# Altium project H_Bridge_GateFet.PrjPcb
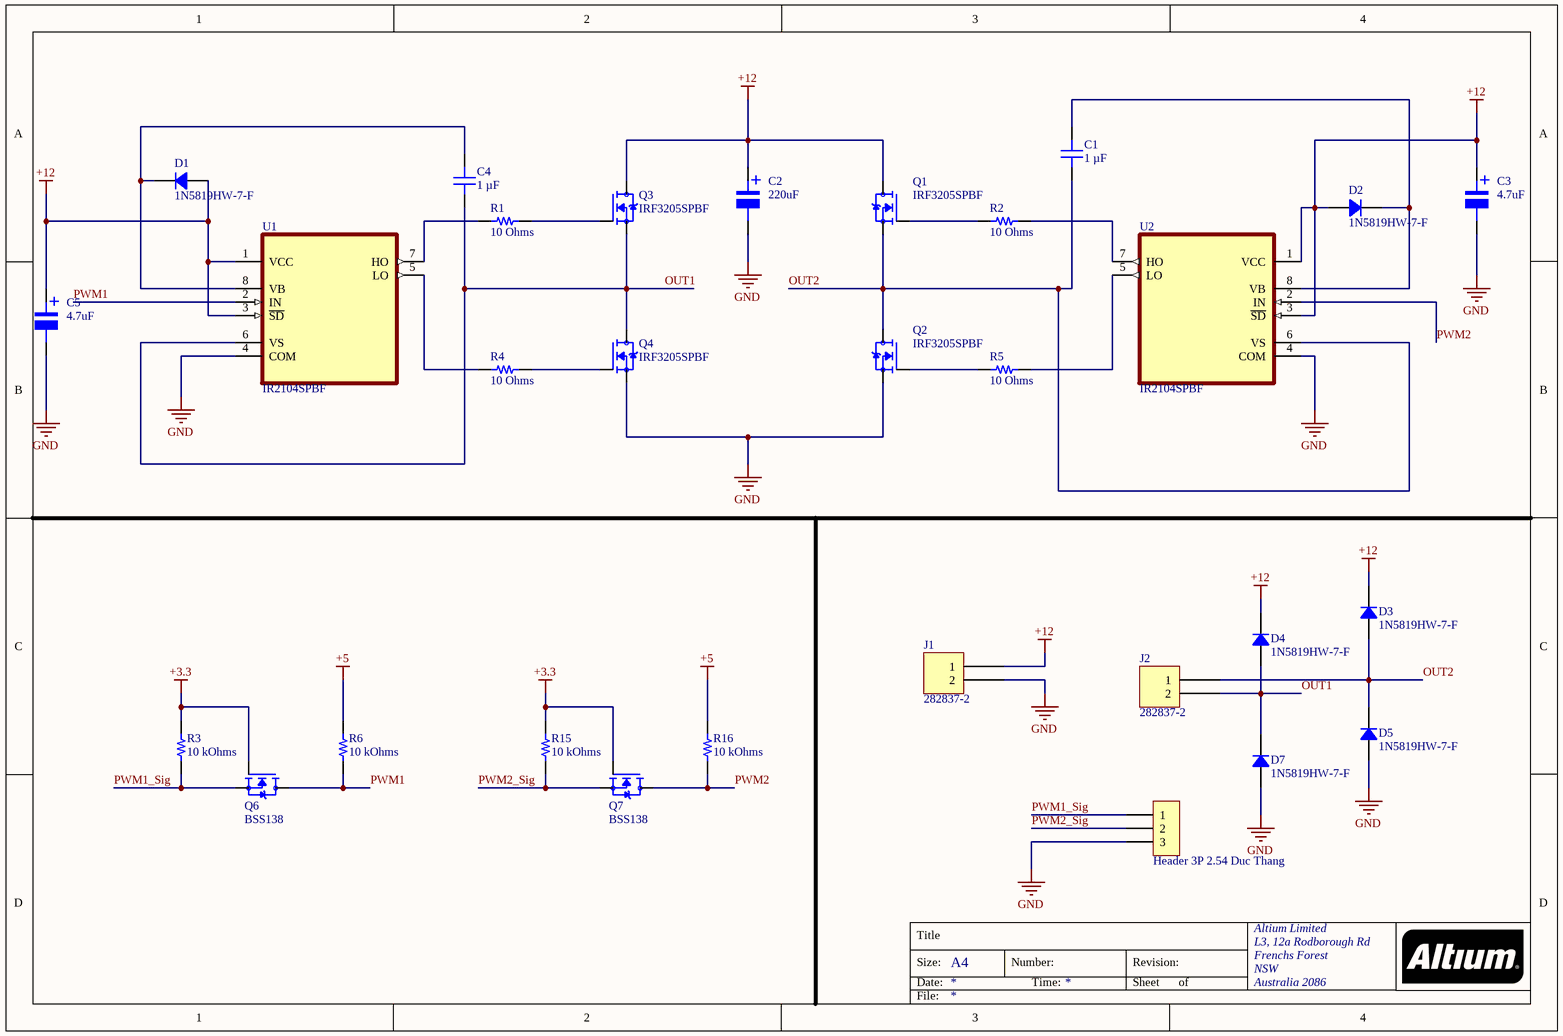
[diagram p0: H_Bridge_Mosate.SchDoc]
2 sheets, 49 parts. Net scope: global (net labels, ports and power ports of the same name join across sheets).
Board file: H-bridge.PcbDoc
Sheets:
  H_Bridge_Mosate.SchDoc
  Power.SchDoc

## Sheet H_Bridge_Mosate.SchDoc
size A4; Organization: Altium Limited; Address1: L3, 12a Rodborough Rd; Address2: Frenchs Forest; Address3: NSW; Address4: Australia 2086

### Parts
C1  1 µF  [CAP 0603_1608]
C2  220uF  [tu nhom 8 (f)]
C3  4.7uF  [tu nhom 4 (b)]
C4  1 µF  [CAP 0603_1608]
C5  4.7uF  [tu nhom 4 (b)]
D1  1N5819HW-7-F  [SOD-123]
D2  1N5819HW-7-F  [SOD-123]
D3  1N5819HW-7-F  [SOD-123]
D4  1N5819HW-7-F  [SOD-123]
D5  1N5819HW-7-F  [SOD-123]
D7  1N5819HW-7-F  [SOD-123]
H1  Header 3P 2.54 Duc Thang  [XH2.54M-3]
J1  282837-2  [TE 282837-2]
J2  282837-2  [TE 282837-2]
Q1  IRF3205SPBF  [TRANS_IRF3205SPBF]
Q2  IRF3205SPBF  [TRANS_IRF3205SPBF]
Q3  IRF3205SPBF  [TRANS_IRF3205SPBF]
Q4  IRF3205SPBF  [TRANS_IRF3205SPBF]
Q6  BSS138  [SOT95P240X111-3N]
Q7  BSS138  [SOT95P240X111-3N]
R1  10 Ohms  [RES 0603_1608]
R2  10 Ohms  [RES 0603_1608]
R3  10 kOhms  [RES 0603_1608]
R4  10 Ohms  [RES 0603_1608]
R5  10 Ohms  [RES 0603_1608]
R6  10 kOhms  [RES 0603_1608]
R15  10 kOhms  [RES 0603_1608]
R16  10 kOhms  [RES 0603_1608]
U1  IR2104SPBF  [SOIC127P600X175-8N]
U2  IR2104SPBF  [SOIC127P600X175-8N]

### Nets
+3.3: Q6.1(G) Q7.1(G) R3.2 R15.2
+5: R6.2 R16.2
+12: C2.1 C3.1 C5.1 D1.1 D2.1 D3.2 D4.2 J1.1 Q1.2(D) Q3.2(D) U1.1(VCC) U1.3(~{SD}) U2.1(VCC) U2.3(~{SD})
GND: C2.2 C3.2 C5.2 D5.1 D7.1 H1.3 J1.2 Q2.3(S) Q4.3(S) U1.4(COM) U2.4(COM)
OUT1: C4.1 D4.1 D7.2 J2.2 Q3.3(S) Q4.2(D) U1.6(VS)
OUT2: C1.1 D3.1 D5.2 J2.1 Q1.3(S) Q2.2(D) U2.6(VS)
PWM1: Q6.3(D) R6.1 U1.2(IN)
PWM1_Sig: H1.1 Q6.2(S) R3.1
PWM2: Q7.3(D) R16.1 U2.2(IN)
PWM2_Sig: H1.2 Q7.2(S) R15.1
NetC1_2: C1.2 D2.2 U2.8(VB)
NetC4_2: C4.2 D1.2 U1.8(VB)
NetQ1_1: Q1.1(G) R2.1
NetQ2_1: Q2.1(G) R5.1
NetQ3_1: Q3.1(G) R1.2
NetQ4_1: Q4.1(G) R4.2
NetR1_1: R1.1 U1.7(HO)
NetR2_2: R2.2 U2.7(HO)
NetR4_1: R4.1 U1.5(LO)
NetR5_2: R5.2 U2.5(LO)

### Notes on the sheet
- Title
- Size:
- Date:
- A4
- Number:
- Time:
- Revision:
- Sheet
- of
- File:
- (in symbol Tu Nhom 4.7uF 25V) +
- (in symbol Tu Nhom 220uF 25V) +

### Library data of the parts
C1 C4 = GCG188L8EE105KA07D: CAP CER 1UF 16V X8L 0603; manufacturer: Murata Electronics; Tolerance: ±10%; Part Number: GCG188L8EE105KA07D; Value: 1 µF; Applications: Automotive; Capacitance: 1 µF; componentlink2description: DigiKey Link; componentlink2url: https://www.digikey.com/en/products/detail/murata-electronics/GCG188L8EE105KA07D/10695125; Device Package: 0603 (1608 Metric); Features: Epoxy Mountable; lastupdated: 2/9/2024 8:09:54 PM; Lifecycle Status: Active; Minimum Order: 1; Mounting Type: Surface Mount, MLCC; Operating Temperature: -55°C ~ 150°C; Package / Case: 0603 (1608 Metric); packaging: TapeAndReel; partid: 46174; Part Status: Active; price: 0.04; Ratings: AEC-Q200; series: GCG; Size / Dimension: 0.063" L x 0.031" W (1.60mm x 0.80mm); Supplier 1: DigiKey; Supplier Part Number 1: 490-GCG188L8EE105KA07DCT-ND; Temperature Coefficient: X8L; Thickness (Max): 0.035" (0.90mm); Voltage - Rated: 16V
C2 = Tu Nhom 220uF 25V: Dán; Don_Vi: Con; So_Chan: 2; Ten_Linh_Kien: Tụ Nhôm 220uF 25V; Ma_Hang: MH002221; Chung_Loai: Dán; Kieu_Chan: *
C3 C5 = Tu Nhom 4.7uF 25V: Dán; Don_Vi: Con; So_Chan: 2; Ten_Linh_Kien: Tụ Nhôm 4.7uF 25V 4x4.5MM; Ma_Hang: MH003790; Chung_Loai: Dán; Kieu_Chan: *
D1-D5 D7 = 1N5819HW-7-F: DIODE SCHOTTKY 40V 1A SOD123; Manufacturer: Diodes Incorporated; Capacitance @ Vr, F: 60pF @ 4V, 1MHz; Current - Reverse Leakage @ Vr: 1 mA @ 40 V; Speed: Fast Recovery =< 500ns, > 200mA (Io); Voltage - Forward (Vf) (Max) @ If: 450 mV @ 1 A; Part Number: 1N5819HW-7-F; ComponentLink1Description: Datasheet; ComponentLink1URL: https://www.diodes.com/assets/Datasheets/ds30217.pdf; ComponentLink2Description: DigiKey Link; ComponentLink2URL: https://www.digikey.com/en/products/detail/diodes-incorporated/1N5819HW-7-F/814970; Current - Average Rectified (Io): 1A; Diode Type: Schottky; LastUpdated: 6/3/2024 7:54:46 PM; Lifecycle Status: Active; Minimum Order: 1; Mounting Type: Surface Mount; Operating Temperature - Junction: -65°C ~ 125°C; Package / Case: SOD-123; Packaging: TapeAndReel; PartId: 2212; Part Status: Active; Price: 0.05; Series: -; Supplier 1: DigiKey; Supplier Part Number 1: 1N5819HW-FDICT-ND; Supplier Device Package: SOD-123; Voltage - DC Reverse (Vr) (Max): 40 V
H1 = Header 3P 2.54 Duc Thang: Cắm; Ten_Linh_Kien: Header 3P XH2.54-3P Đực Thẳng; Don_Vi: Con; Ma_Hang: MH001292; Chung_Loai: Cắm
J1 J2 = 282837-2: TERM BLK 2P SIDE ENT 5.08MM PCB; Manufacturer: TE Connectivity AMP Connectors; Current: 13.5 A; Mating Orientation: Horizontal with Board; Number of Levels: 1; Pitch: 0.200" (5.08mm); Positions Per Level: 2; Voltage: 300 V; Wire Gauge: 16-28 AWG; Wire Termination: Screw - Rising Cage Clamp; Part Number: 282837-2; Color: Green; ComponentLink1Description: Datasheet; ComponentLink1URL: https://www.te.com/commerce/DocumentDelivery/DDEController?Action=srchrtrv&DocNm=282837&DocType=Customer+Drawing&DocLang=English; ComponentLink2Description: DigiKey Link; ComponentLink2URL: https://www.digikey.com/en/products/detail/te-connectivity-amp-connectors/282837-2/2187973; Features: Interlocking (Side); LastUpdated: 6/21/2022 3:00:23 PM; Lifecycle Status: Active; Minimum Order: 1; Mounting Type: Through Hole; Packaging: Tray; Part Status: Active; Price: 0.31; Series: Buchanan; Supplier 1: DigiKey; Supplier Part Number 1: A113320-ND
Q1-Q4 = IRF3205SPBF: RoHS Compliant | Low RDS_on_ | Industry-leading quality | Dynamic dv/dt Rating | Fast Switching | Fully Avalanche Rated | 175C Operating Temperature; MF: Infineon Technologies; Package: D2PAK Infineon; Price: None; SnapEDA_Link: https://www.snapeda.com/parts/IRF3205SPBF/Infineon%20Technologies/view-part/576468/?ref=snap; Availability: Unavailable; Value: *; MP: IRF3205SPBF
Q6 Q7 = BSS138: N-Channel 50 V 220mA (Ta) 350mW (Ta) Surface Mount SOT-23-3; MF: onsemi; SnapEDA_Link: https://www.snapeda.com/parts/BSS138/Onsemi/view-part/?ref=snap; Package: SOT-23-3 Motorola; Value: *; MP: BSS138; Check_prices: https://www.snapeda.com/parts/BSS138/Onsemi/view-part/?ref=eda
R1 R2 R4 R5 = ERJ-UP3F10R0V: RES 10 OHM 1% 1/4W 0603; Manufacturer: Panasonic Electronic Components; Power (Watts): 0.25W, 1/4W; Temperature Coefficient: ±100ppm/°C; Part Number: ERJ-UP3F10R0V; Value: 10 Ohms; ComponentLink1Description: Datasheet; ComponentLink1URL: https://b2b-api.panasonic.eu/file_stream/pids/fileversion/4484; ComponentLink2Description: DigiKey Link; ComponentLink2URL: https://www.digikey.com/en/products/detail/panasonic-electronic-components/ERJ-UP3F10R0V/12092098; Composition: Thick Film; Device Package: 0603 (1608 Metric); Features: Anti-Sulfur, Automotive AEC-Q200, Pulse Withstanding; Height - Seated (Max): 0.022" (0.55mm); LastUpdated: 2/9/2024 8:41:13 PM; Lifecycle Status: Active; Minimum Order: 1; Number of Terminations: 2; Operating Temperature: -55°C ~ 155°C; Package / Case: 0603 (1608 Metric); Packaging: TapeAndReel; PartId: 66744; Part Status: Active; Price: 0.02; Ratings: AEC-Q200; Resistance: 10 Ohms; Series: ERJ-UP3; Size / Dimension: 0.063" L x 0.031" W (1.60mm x 0.80mm); Supplier 1: DigiKey; Supplier Part Number 1: 10-ERJ-UP3F10R0VCT-ND; Supplier Device Package: 0603; Tolerance: ±1%
R3 R6 R15 R16 = AC0603FR-0710KL: RES SMD 10K OHM 1% 1/10W 0603; Manufacturer: Yageo; Power (Watts): 0.1W, 1/10W; Temperature Coefficient: ±100ppm/°C; Part Number: AC0603FR-0710KL; Value: 10 kOhms; ComponentLink1Description: Datasheet; ComponentLink1URL: https://www.yageo.com/upload/media/product/productsearch/datasheet/rchip/PYu-AC_51_RoHS_L_7.pdf; ComponentLink2Description: DigiKey Link; ComponentLink2URL: https://www.digikey.com/en/products/detail/yageo/AC0603FR-0710KL/2827814; Composition: Thick Film; Device Package: 0603 (1608 Metric); Features: Automotive AEC-Q200, Moisture Resistant; Height - Seated (Max): 0.022" (0.55mm); LastUpdated: 2/9/2024 8:42:48 PM; Lifecycle Status: Active; Minimum Order: 1; Number of Terminations: 2; Operating Temperature: -55°C ~ 155°C; Package / Case: 0603 (1608 Metric); Packaging: CutTape; PartId: 17347; Part Status: Active; Price: 0.01; Ratings: AEC-Q200; Resistance: 10 kOhms; Series: AC; Size / Dimension: 0.063" L x 0.031" W (1.60mm x 0.80mm); Supplier 1: DigiKey; Supplier Part Number 1: 311-10KLDCT-ND; Supplier Device Package: 0603; Tolerance: ±1%
U1 U2 = IR2104SPBF: Floating channel designed for bootstrap operation | Fully operational to +600 V | Tolerant to negative transient voltage | dV/dt immune | Gate drive supply range from 10 to 20 V | Undervoltage lockout | 3.3 V, 5 V, and 15 V logic input compatible | Cross-conduction prevention logic | Matched propagation delay for both channels | Internal set deadtime | High side output in phase with HIN input | Shut down input turns off both channels; MF: Infineon; Purchase-URL: https://pricing.snapeda.com/search/part/IR2104SPBF/?ref=eda; MP: IR2104SPBF; SnapEDA_Link: https://www.snapeda.com/parts/IR2104SPBF/Infineon%20Technologies/view-part/61964/?ref=snap; Price: None; Package: SOIC-8 International Rectifier; Value: *; Availability: Warning; Check_prices: https://www.snapeda.com/parts/IR2104SPBF/Infineon%20Technologies/view-part/61964/?ref=eda

## Sheet Power.SchDoc
size A4; Organization: Altium Limited; Address1: L3, 12a Rodborough Rd; Address2: Frenchs Forest; Address3: NSW; Address4: Australia 2086
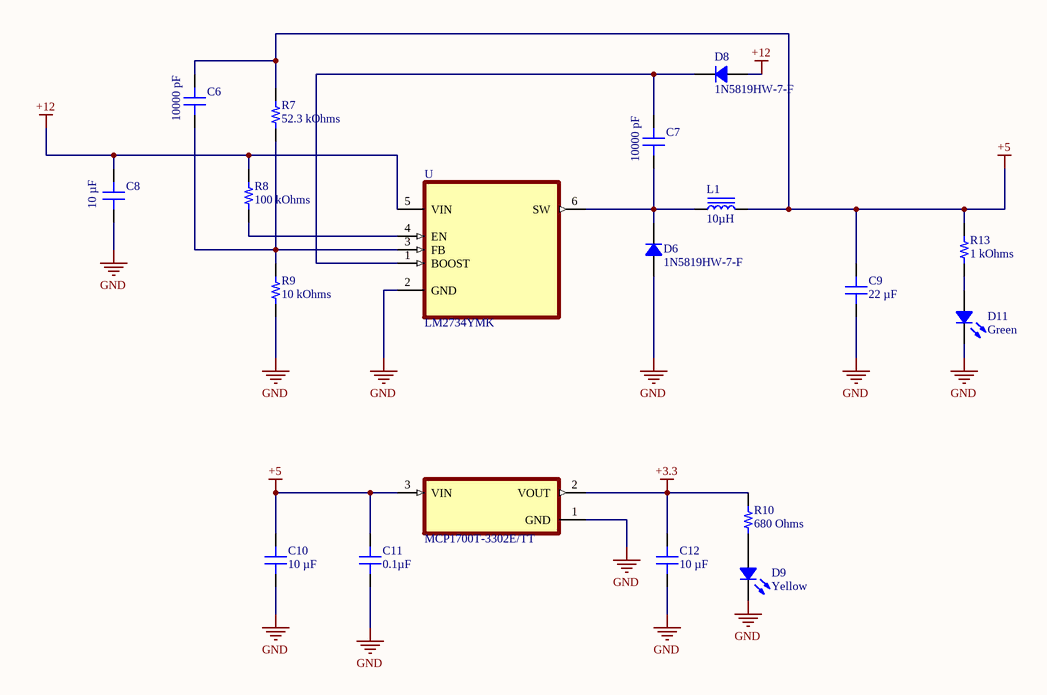
[diagram p1: Power.SchDoc]

### Parts
C6  10000 pF  [CAP 0603_1608]
C7  10000 pF  [CAP 0603_1608]
C8  10 µF  [CAP 0805_2012]
C9  22 µF  [CAP 0805_2012]
C10  10 µF  [CAP 0805_2012]
C11  0.1µF  [CAP 0603_1608]
C12  10 µF  [CAP 0805_2012]
D6  1N5819HW-7-F  [SOD-123]
D8  1N5819HW-7-F  [SOD-123]
D9  Yellow  [LED 0603_1608 YELLOW]
D11  Green  [LED 0402_1005 GREEN]
L1  10µH  [TDK SLF7032]
R7  52.3 kOhms  [RES 0603_1608]
R8  100 kOhms  [RES 0603_1608]
R9  10 kOhms  [RES 0603_1608]
R10  680 Ohms  [RES 0603_1608]
R13  1 kOhms  [RES 0603_1608]
U  LM2734YMK  [SOT95P285X100-6N]
  MCP1700T-3302E/TT  [SOT95P237X112-3N]

### Nets
+3.3: C12.2 R10.2 .2(VOUT)
+5: C6.2 C9.2 C10.2 C11.2 L1.2 R7.2 R13.2 .3(VIN)
+12: C8.2 D8.1 R8.2 U.5(VIN)
GND: C8.1 C9.1 C10.1 C11.1 C12.1 D6.1 D9.2 D11.2 R9.1 U.2(GND) .1(GND)
NetC6_1: C6.1 R7.1 R9.2 U.3(FB)
NetC7_1: C7.1 D6.2 L1.1 U.6(SW)
NetC7_2: C7.2 D8.2 U.1(BOOST)
NetD9_1: D9.1 R10.1
NetD11_1: D11.1 R13.1
NetR8_1: R8.1 U.4(EN)

### Notes on the sheet
- Title
- Size:
- Date:
- A4
- Number:
- Time:
- Revision:
- Sheet
- of
- File:

### Library data of the parts
C6 C7 = C0603C103K4RECAUTO: CAP CER 0603 10NF 16V X7R 10%; manufacturer: KEMET; Part Number: C0603C103K4RECAUTO; Value: 10000 pF; Applications: Automotive, ESD Protection; Capacitance: 10000 pF; componentlink1description: Datasheet; componentlink1url: https://api.kemet.com/component-edge/download/datasheet/C0603C103K4RECAUTO.pdf; componentlink2description: DigiKey Link; componentlink2url: https://www.digikey.com/en/products/detail/kemet/C0603C103K4RECAUTO/8640474; Device Package: 0603 (1608 Metric); lastupdated: 2/9/2024 8:10:22 PM; Lifecycle Status: Active; Minimum Order: 1; Mounting Type: Surface Mount, MLCC; Operating Temperature: -55°C ~ 125°C; Package / Case: 0603 (1608 Metric); packaging: TapeAndReel; partid: 8251; Part Status: Active; price: 0.01; Ratings: AEC-Q200; series: ESD SMD Auto X7R; Size / Dimension: 0.063" L x 0.031" W (1.60mm x 0.80mm); Supplier 1: DigiKey; Supplier Part Number 1: 399-17880-1-ND; Temperature Coefficient: X7R; Thickness (Max): 0.034" (0.87mm); Tolerance: ±10%; Voltage - Rated: 16V
C8 = CL21X106KAYNNNE: CAP CER 10UF 25V X6S 0805; manufacturer: Samsung Electro-Mechanics; Tolerance: ±10%; Part Number: CL21X106KAYNNNE; Value: 10 µF; Applications: General Purpose; Capacitance: 10 µF; componentlink1description: Datasheet; componentlink1url: http://www.samsungsem.com/kr/support/product-search/mlcc/CL21X106KAYNNNE.jsp; componentlink2description: DigiKey Link; componentlink2url: https://www.digikey.com/en/products/detail/samsung-electro-mechanics/CL21X106KAYNNNE/5961182; Device Package: 0805 (2012 Metric); lastupdated: 2/9/2024 8:16:03 PM; Lifecycle Status: Active; Minimum Order: 1; Mounting Type: Surface Mount, MLCC; Operating Temperature: -55°C ~ 105°C; Package / Case: 0805 (2012 Metric); packaging: TapeAndReel; partid: 4781; Part Status: Active; price: 0.04; series: CL; Size / Dimension: 0.079" L x 0.049" W (2.00mm x 1.25mm); Supplier 1: DigiKey; Supplier Part Number 1: 1276-6698-1-ND; Temperature Coefficient: X6S; Thickness (Max): 0.057" (1.45mm); Voltage - Rated: 25V
C9 = CL21A226KQQNNNE: CAP CER 22UF 6.3V X5R 0805; manufacturer: Samsung Electro-Mechanics; Tolerance: ±10%; Part Number: CL21A226KQQNNNE; Value: 22 µF; Applications: General Purpose; Capacitance: 22 µF; componentlink1description: Datasheet; componentlink1url: http://www.samsungsem.com/kr/support/product-search/mlcc/CL21A226KQQNNNE.jsp; componentlink2description: DigiKey Link; componentlink2url: https://www.digikey.com/en/products/detail/samsung-electro-mechanics/CL21A226KQQNNNE/3888565; Device Package: 0805 (2012 Metric); lastupdated: 2/9/2024 8:16:07 PM; Lifecycle Status: Active; Minimum Order: 1; Mounting Type: Surface Mount, MLCC; Operating Temperature: -55°C ~ 85°C; Package / Case: 0805 (2012 Metric); packaging: TapeAndReel; partid: 3051; Part Status: Active; price: 0.03; series: CL; Size / Dimension: 0.079" L x 0.049" W (2.00mm x 1.25mm); Supplier 1: DigiKey; Supplier Part Number 1: 1276-2907-1-ND; Temperature Coefficient: X5R; Thickness (Max): 0.055" (1.40mm); Voltage - Rated: 6.3V
C10 C12 = C2012X6S1C106K125AC: CAP CER 10UF 16V X6S 0805; manufacturer: TDK Corporation; Tolerance: ±10%; Part Number: C2012X6S1C106K125AC; Value: 10 µF; Applications: General Purpose; Capacitance: 10 µF; componentlink1description: Datasheet; componentlink1url: https://product.tdk.com/info/en/catalog/datasheets/mlcc_commercial_general_en.pdf?ref_disty=digikey; componentlink2description: DigiKey Link; componentlink2url: https://www.digikey.com/en/products/detail/tdk-corporation/C2012X6S1C106K125AC/2733046; Device Package: 0805 (2012 Metric); Features: Low ESL; lastupdated: 2/9/2024 8:16:08 PM; Lifecycle Status: Active; Minimum Order: 1; Mounting Type: Surface Mount, MLCC; Operating Temperature: -55°C ~ 105°C; Package / Case: 0805 (2012 Metric); packaging: TapeAndReel; partid: 2995; Part Status: Active; price: 0.06; series: C; Size / Dimension: 0.079" L x 0.049" W (2.00mm x 1.25mm); Supplier 1: DigiKey; Supplier Part Number 1: 445-7611-1-ND; Temperature Coefficient: X6S; Thickness (Max): 0.057" (1.45mm); Voltage - Rated: 16V
C11 = 0603YC104K4T4A: CAP CER 0.1UF 16V X7R 0603; manufacturer: AVX Corporation; Tolerance: ±10%; Part Number: 0603YC104K4T4A; Value: 0.1µF; Applications: Automotive; Capacitance: 0.1µF; componentlink1description: Datasheet; componentlink1url: http://datasheets.avx.com/AutoMLCC.pdf; componentlink2description: DigiKey Link; componentlink2url: http://digikey.com/product-detail/en/avx-corporation/0603YC104K4T4A/478-9382-1-ND/4901449; Device Package: 0603 (1608 Metric); lastupdated: 9/2/2020 1:03:04 AM; Lifecycle Status: Active; Minimum Order: 1; Mounting Type: Surface Mount, MLCC; Operating Temperature: -55°C ~ 125°C; Package / Case: 0603 (1608 Metric); packaging: TapeAndReel; partid: 17140; Part Status: Active; price: 0.02; Ratings: AEC-Q200; series: -; Size / Dimension: 0.063" L x 0.032" W (1.60mm x 0.81mm); Supplier 1: DigiKey; Supplier Part Number 1: 478-9382-1-ND; Temperature Coefficient: X7R; Thickness (Max): 0.035" (0.90mm); Voltage - Rated: 16V
D6 D8 = 1N5819HW-7-F: as D1 on sheet H_Bridge_Mosate; Part Number: 1N5819HW-7-F; ComponentLink1Description: Datasheet; ComponentLink1URL: https://www.diodes.com/assets/Datasheets/ds30217.pdf; ComponentLink2Description: DigiKey Link; ComponentLink2URL: https://www.digikey.com/en/products/detail/diodes-incorporated/1N5819HW-7-F/814970; Current - Average Rectified (Io): 1A; Diode Type: Schottky; LastUpdated: 6/3/2024 7:54:46 PM; Lifecycle Status: Active; Minimum Order: 1; Mounting Type: Surface Mount; Operating Temperature - Junction: -65°C ~ 125°C; Package / Case: SOD-123; Packaging: TapeAndReel; PartId: 2212; Part Status: Active; Price: 0.05; Series: -; Supplier 1: DigiKey; Supplier Part Number 1: 1N5819HW-FDICT-ND; Supplier Device Package: SOD-123; Voltage - DC Reverse (Vr) (Max): 40 V
D9 = IN-S63AT5Y: LED YELLOW CLEAR 0603 SMD; Manufacturer: Inolux; Configuration: Standard; Current - Test: 5mA; Lens Size: 1.15mm x 0.80mm; Lens Style: Rectangle with Flat Top; Millicandela Rating: 35mcd; Viewing Angle: 120°; Voltage - Forward (Vf) (Typ): 2V; Wavelength - Dominant: 589nm; Wavelength - Peak: 593nm; Part Number: IN-S63AT5Y; Color: Yellow; ComponentLink1Description: Datasheet; ComponentLink1URL: http://www.inolux-corp.com/datasheet/SMDLED/Mono%20Color%20Top%20View/IN-S63AT%20Series_V1.1.pdf; ComponentLink2Description: DigiKey Link; ComponentLink2URL: https://www.digikey.com/en/products/detail/inolux/IN-S63AT5Y/7604932; Device Package: 0603 (1608 Metric); Height (Max): 0.40mm; LastUpdated: 6/3/2024 8:01:09 PM; Lens Color: Clear; Lens Transparency: Clear; Lifecycle Status: Active; Minimum Order: 1; Mounting Type: Surface Mount; Package / Case: 0603 (1608 Metric); Packaging: TapeAndReel; PartId: 143; Part Status: Active; Price: 0.03; Series: IN-S63AT; Size / Dimension: 1.60mm L x 0.80mm W; Supplier 1: DigiKey; Supplier Part Number 1: 1830-1066-1-ND; Supplier Device Package: 0603; Value: Yellow
D11 = QBLP595-AG15-2897: LED GREEN CLEAR 0402 SMD; Manufacturer: QT Brightek (QTB); Configuration: Standard; Current - Test: 5mA; Lens Color: Colorless; Lens Size: 0.70mm x 0.50mm; Lens Style: Rectangle with Flat Top; Millicandela Rating: 16.5mcd; Viewing Angle: 140°; Voltage - Forward (Vf) (Typ): 1.9V; Wavelength - Dominant: 570nm; Part Number: QBLP595-AG15-2897; Color: Green; ComponentLink1Description: Datasheet; ComponentLink1URL: https://www.qt-brightek.com/datasheet/QBLP595-AG15-2897.pdf; ComponentLink2Description: DigiKey Link; ComponentLink2URL: https://www.digikey.com/en/products/detail/qt-brightek-qtb/QBLP595-AG15-2897/17049386; Device Package: 0402 (1005 Metric); Height (Max): 0.60mm; LastUpdated: 6/3/2024 7:58:13 PM; Lens Transparency: Clear; Lifecycle Status: Active; Minimum Order: 1; Mounting Type: Surface Mount; Package / Case: 0402 (1005 Metric); Packaging: TapeAndReel; PartId: 1262; Part Status: Active; Price: 0.04; Series: QBLP595; Size / Dimension: 1.00mm L x 0.50mm W; Supplier 1: DigiKey; Supplier Part Number 1: 1516-QBLP595-AG15-2897CT-ND; Supplier Device Package: 0402; Value: Green
L1 = SLF7032T-100M1R4-2PF: FIXED IND 10UH 1.4A 63.6 MOHM; Manufacturer: TDK Corporation; DC Resistance (DCR): 63.6mOhm Max; Inductance Frequency - Test: 100kHz; Material - Core: Ferrite; Shielding: Shielded; Tolerance: ±20%; Type: Wirewound; Part Number: SLF7032T-100M1R4-2PF; ComponentLink1Description: Datasheet; ComponentLink1URL: //media.digikey.com/pdf/Data%20Sheets/TDK%20PDFs/SLF7032_Type.pdf; ComponentLink2Description: DigiKey Link; ComponentLink2URL: http://digikey.com/product-detail/en/tdk-corporation/SLF7032T-100M1R4-2PF/445-1998-1-ND/755405; Current Rating (Amps): 1.4A; Device Package: Nonstandard; Height - Seated (Max): 0.134" (3.40mm); Inductance: 10µH; LastUpdated: 9/2/2020 1:30:24 AM; Lifecycle Status: Active; Minimum Order: 1; Mounting Type: Surface Mount; Operating Temperature: -40°C ~ 105°C; Package / Case: Nonstandard; Packaging: TapeAndReel; PartId: 3677; Part Status: Active; Price: 0.43; Series: SLF; Size / Dimension: 0.276" L x 0.276" W (7.00mm x 7.00mm); Supplier 1: DigiKey; Supplier Part Number 1: 445-1998-1-ND; Value: 10µH
R7 = ERA-3AEB5232V: RES SMD 52.3KOHM 0.1% 1/10W 0603; Manufacturer: Panasonic Electronic Components; Power (Watts): 0.1W, 1/10W; Temperature Coefficient: ±25ppm/°C; Part Number: ERA-3AEB5232V; Value: 52.3 kOhms; ComponentLink1Description: Datasheet; ComponentLink1URL: https://industrial.panasonic.com/cdbs/www-data/pdf/RDM0000/AOA0000C307.pdf; ComponentLink2Description: DigiKey Link; ComponentLink2URL: https://www.digikey.com/en/products/detail/panasonic-electronic-components/ERA-3AEB5232V/2026903; Composition: Thin Film; Device Package: 0603 (1608 Metric); Features: Automotive AEC-Q200; Height - Seated (Max): 0.022" (0.55mm); LastUpdated: 2/9/2024 8:42:09 PM; Lifecycle Status: Active; Minimum Order: 1; Number of Terminations: 2; Operating Temperature: -55°C ~ 155°C; Package / Case: 0603 (1608 Metric); Packaging: TapeAndReel; PartId: 24659; Part Status: Active; Price: 0.03; Ratings: AEC-Q200; Resistance: 52.3 kOhms; Series: ERA-3A; Size / Dimension: 0.063" L x 0.031" W (1.60mm x 0.80mm); Supplier 1: DigiKey; Supplier Part Number 1: P52.3KDBCT-ND; Supplier Device Package: 0603; Tolerance: ±0.1%
R8 = RCA0603100KJNEA: RES SMD 100K OHM 5% 1/10W 0603; Manufacturer: Vishay Dale; Power (Watts): 0.1W, 1/10W; Temperature Coefficient: ±200ppm/°C; Part Number: RCA0603100KJNEA; Value: 100 kOhms; ComponentLink1Description: Datasheet; ComponentLink1URL: http://www.vishay.com/docs/20037/rcae3.pdf; ComponentLink2Description: DigiKey Link; ComponentLink2URL: https://www.digikey.com/en/products/detail/vishay-dale/RCA0603100KJNEA/4946784; Composition: Thick Film; Device Package: 0603 (1608 Metric); Features: Anti-Sulfur, Automotive AEC-Q200; Height - Seated (Max): 0.020" (0.50mm); LastUpdated: 2/9/2024 8:42:20 PM; Lifecycle Status: Active; Minimum Order: 1; Number of Terminations: 2; Operating Temperature: -55°C ~ 155°C; Package / Case: 0603 (1608 Metric); Packaging: TapeAndReel; PartId: 23468; Part Status: Active; Price: 0.01; Ratings: AEC-Q200; Resistance: 100 kOhms; Series: RCA; Size / Dimension: 0.061" L x 0.033" W (1.55mm x 0.85mm); Supplier 1: DigiKey; Supplier Part Number 1: 541-2215-1-ND; Supplier Device Package: 0603; Tolerance: ±5%
R9 = TNPU060310K0BZEN00: RES SMD 10K OHM 0.1% 1/10W 0603; Manufacturer: Vishay Dale; Power (Watts): 0.1W, 1/10W; Temperature Coefficient: ±5ppm/°C; Part Number: TNPU060310K0BZEN00; Value: 10 kOhms; ComponentLink1Description: Datasheet; ComponentLink1URL: http://www.vishay.com/docs/28779/tnpue3.pdf; ComponentLink2Description: DigiKey Link; ComponentLink2URL: https://www.digikey.com/en/products/detail/vishay-dale/TNPU060310K0BZEN00/2238348; Composition: Thin Film; Device Package: 0603 (1608 Metric); Features: Anti-Sulfur, Automotive AEC-Q200, Moisture Resistant; Height - Seated (Max): 0.022" (0.55mm); LastUpdated: 2/9/2024 8:43:27 PM; Lifecycle Status: Active; Minimum Order: 1; Number of Terminations: 2; Operating Temperature: -55°C ~ 125°C; Package / Case: 0603 (1608 Metric); Packaging: TapeAndReel; PartId: 7183; Part Status: Active; Price: 0.88; Ratings: AEC-Q200; Resistance: 10 kOhms; Series: TNPU e3; Size / Dimension: 0.063" L x 0.033" W (1.60mm x 0.85mm); Supplier 1: DigiKey; Supplier Part Number 1: TNPU10.0KBACT-ND; Supplier Device Package: 0603; Tolerance: ±0.1%
R10 = RT0603CRD07680RL: RES SMD 680 OHM 0.25% 1/10W 0603; Manufacturer: Yageo; Power (Watts): 0.1W, 1/10W; Temperature Coefficient: ±25ppm/°C; Part Number: RT0603CRD07680RL; Value: 680 Ohms; ComponentLink1Description: Datasheet; ComponentLink1URL: https://www.yageo.com/upload/media/product/productsearch/datasheet/rchip/PYu-RT_1-to-0.01_RoHS_L_11.pdf; ComponentLink2Description: DigiKey Link; ComponentLink2URL: http://digikey.com/product-detail/en/yageo/RT0603CRD07680RL/YAG4792CT-ND/6616948; Composition: Thin Film; Device Package: 0603 (1608 Metric); Height - Seated (Max): 0.022" (0.55mm); LastUpdated: 2/9/2024 8:42:46 PM; Lifecycle Status: Active; Minimum Order: 1; Number of Terminations: 2; Operating Temperature: -55°C ~ 155°C; Package / Case: 0603 (1608 Metric); Packaging: TapeAndReel; PartId: 17637; Part Status: Active; Price: 0.07; Resistance: 680 Ohms; Series: RT; Size / Dimension: 0.063" L x 0.031" W (1.60mm x 0.80mm); Supplier 1: DigiKey; Supplier Part Number 1: YAG4792CT-ND; Supplier Device Package: 0603; Tolerance: ±0.25%
R13 = RN73R1JTTD1001B25: RES 1K OHM 0.1% 1/10W 0603; Manufacturer: KOA Speer Electronics, Inc.; Power (Watts): 0.1W, 1/10W; Temperature Coefficient: ±25ppm/°C; Part Number: RN73R1JTTD1001B25; Value: 1 kOhms; ComponentLink1Description: Datasheet; ComponentLink1URL: //media.digikey.com/pdf/Data%20Sheets/KOA%20Speer/RN73R_Type_DS.pdf; ComponentLink2Description: DigiKey Link; ComponentLink2URL: https://www.digikey.com/en/products/detail/koa-speer-electronics-inc/RN73R1JTTD1001B25/9991865; Composition: Thin Film; Device Package: 0603 (1608 Metric); Features: Automotive AEC-Q200, Moisture Resistant; Height - Seated (Max): 0.022" (0.55mm); LastUpdated: 2/9/2024 8:43:22 PM; Lifecycle Status: Active; Minimum Order: 1; Number of Terminations: 2; Operating Temperature: -55°C ~ 155°C; Package / Case: 0603 (1608 Metric); Packaging: TapeAndReel; PartId: 8387; Part Status: Active; Price: 0.05; Ratings: AEC-Q200; Resistance: 1 kOhms; Series: RN73R; Size / Dimension: 0.063" L x 0.031" W (1.60mm x 0.80mm); Supplier 1: DigiKey; Supplier Part Number 1: 2019-RN73R1JTTD1001B25CT-ND; Supplier Device Package: 0603; Tolerance: ±0.1%
U = LM2734YMK: Buck Switching Regulator IC Positive Adjustable 0.8V 1 Output 1A SOT-23-6 Thin, TSOT-23-6; MF: Texas Instruments; SnapEDA_Link: https://www.snapeda.com/parts/LM2734YMK/Texas%20Instruments/view-part/105783/?ref=snap; Price: None; Availability: Unavailable; Package: SOT-23 Texas Instruments; MP: LM2734YMK; Value: *
 = MCP1700T-3302E/TT: Linear Voltage Regulator IC 1 Output 250mA SOT-23-3; MF: Microchip

## Nets that join several sheets
+3.3: H_Bridge_Mosate (Q6.1 Q7.1 R3.2 R15.2), Power (C12.2 R10.2 .2)
+5: H_Bridge_Mosate (R6.2 R16.2), Power (8 pins)
+12: H_Bridge_Mosate (14 pins), Power (C8.2 D8.1 R8.2 U.5)
GND: H_Bridge_Mosate (11 pins), Power (11 pins)